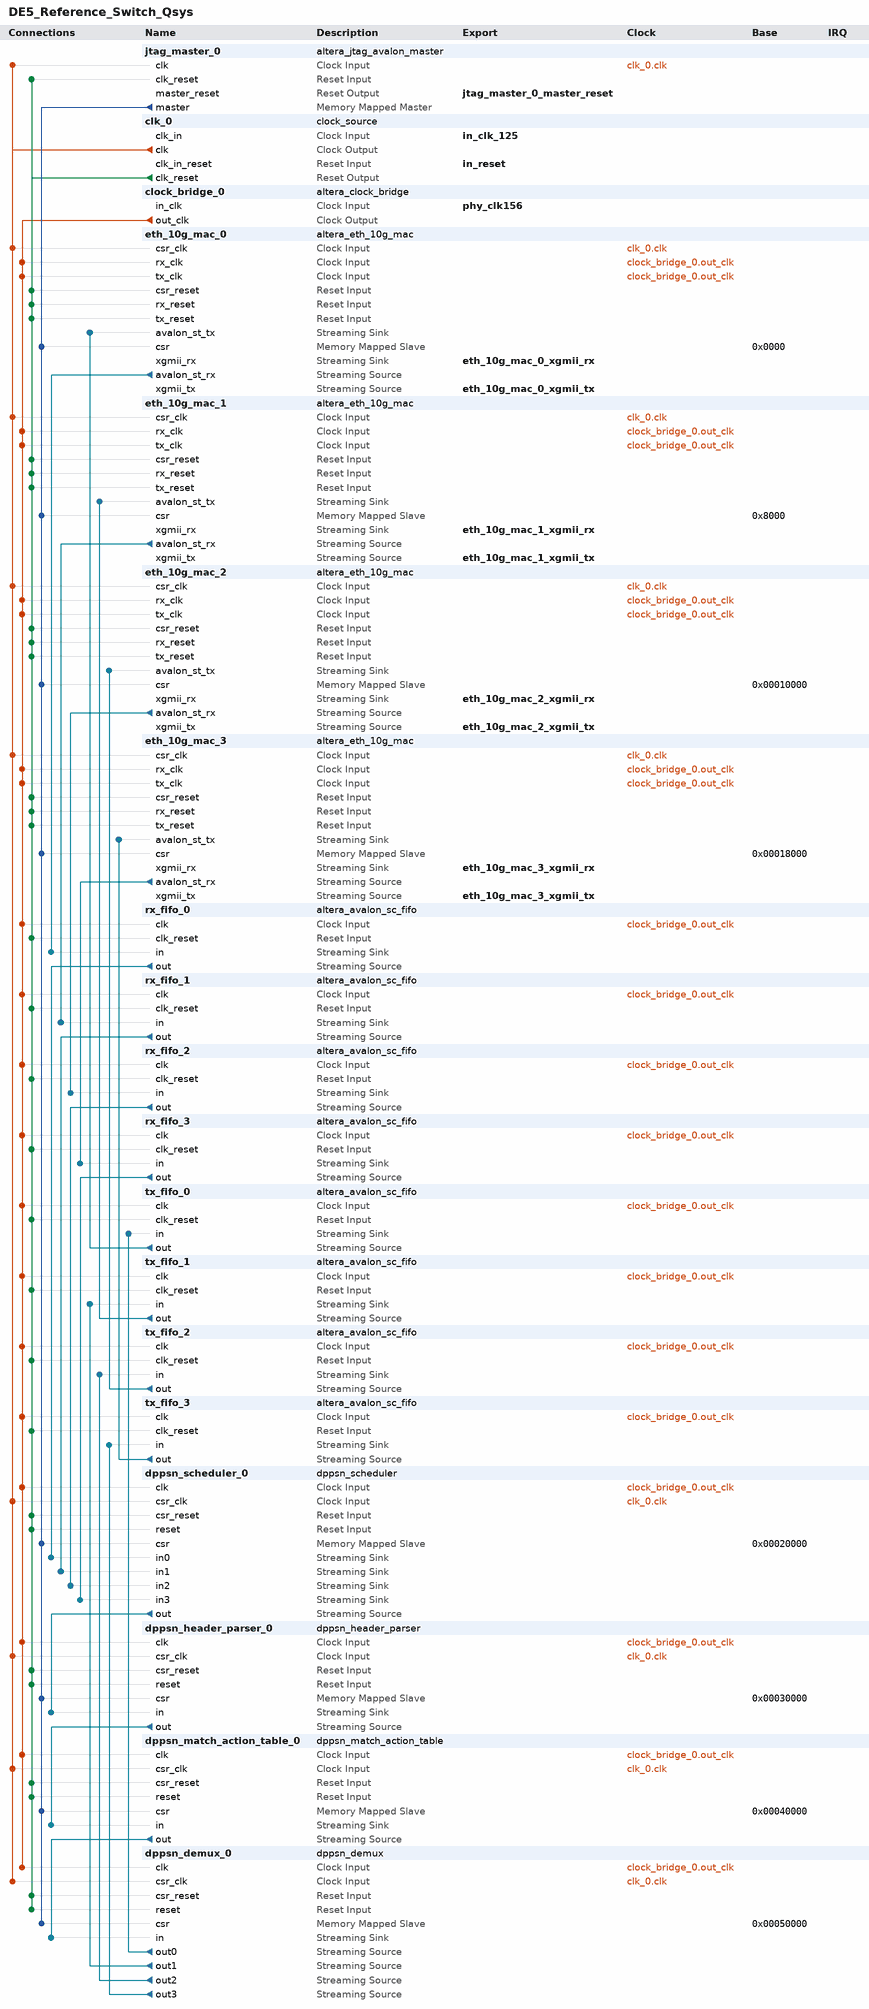
[diagram p0: system contents]
# Platform Designer (Qsys) system DE5_Reference_Switch_Qsys, Stratix V 5SGXEA7N2F45C2
# Parameters at their usual value, and those the tool derives, are not listed.
package require -exact qsys 16.1
create_system DE5_Reference_Switch_Qsys
set_project_property DEVICE_FAMILY {Stratix V}
set_project_property DEVICE 5SGXEA7N2F45C2

add_instance jtag_master_0 altera_jtag_avalon_master 16.1

add_instance clk_0 clock_source 16.1
set_instance_parameter_value clk_0 clockFrequency 156250000

add_instance clock_bridge_0 altera_clock_bridge 16.1
set_instance_parameter_value clock_bridge_0 DERIVED_CLOCK_RATE 0
set_instance_parameter_value clock_bridge_0 EXPLICIT_CLOCK_RATE 156250000

add_instance eth_10g_mac_0 altera_eth_10g_mac 16.1
set_instance_parameter_value eth_10g_mac_0 DATAPATH_OPTION 3
set_instance_parameter_value eth_10g_mac_0 ENABLE_1G10G_MAC 0
set_instance_parameter_value eth_10g_mac_0 ENABLE_PFC 0
set_instance_parameter_value eth_10g_mac_0 ENABLE_PTP_1STEP 0
set_instance_parameter_value eth_10g_mac_0 ENABLE_SUPP_ADDR 1
set_instance_parameter_value eth_10g_mac_0 ENABLE_TIMESTAMPING 0
set_instance_parameter_value eth_10g_mac_0 ENABLE_UNIDIRECTIONAL 0
set_instance_parameter_value eth_10g_mac_0 INSTANTIATE_STATISTICS 1
set_instance_parameter_value eth_10g_mac_0 INSTANTIATE_TX_CRC 1
set_instance_parameter_value eth_10g_mac_0 PFC_PRIORITY_NUM 8
set_instance_parameter_value eth_10g_mac_0 PREAMBLE_PASSTHROUGH 0
set_instance_parameter_value eth_10g_mac_0 REGISTER_BASED_STATISTICS 0
set_instance_parameter_value eth_10g_mac_0 TSTAMP_FP_WIDTH 4

add_instance eth_10g_mac_1 altera_eth_10g_mac 16.1
set_instance_parameter_value eth_10g_mac_1 DATAPATH_OPTION 3
set_instance_parameter_value eth_10g_mac_1 ENABLE_1G10G_MAC 0
set_instance_parameter_value eth_10g_mac_1 ENABLE_PFC 0
set_instance_parameter_value eth_10g_mac_1 ENABLE_PTP_1STEP 0
set_instance_parameter_value eth_10g_mac_1 ENABLE_SUPP_ADDR 1
set_instance_parameter_value eth_10g_mac_1 ENABLE_TIMESTAMPING 0
set_instance_parameter_value eth_10g_mac_1 ENABLE_UNIDIRECTIONAL 0
set_instance_parameter_value eth_10g_mac_1 INSTANTIATE_STATISTICS 1
set_instance_parameter_value eth_10g_mac_1 INSTANTIATE_TX_CRC 1
set_instance_parameter_value eth_10g_mac_1 PFC_PRIORITY_NUM 8
set_instance_parameter_value eth_10g_mac_1 PREAMBLE_PASSTHROUGH 0
set_instance_parameter_value eth_10g_mac_1 REGISTER_BASED_STATISTICS 0
set_instance_parameter_value eth_10g_mac_1 TSTAMP_FP_WIDTH 4

add_instance eth_10g_mac_2 altera_eth_10g_mac 16.1
set_instance_parameter_value eth_10g_mac_2 DATAPATH_OPTION 3
set_instance_parameter_value eth_10g_mac_2 ENABLE_1G10G_MAC 0
set_instance_parameter_value eth_10g_mac_2 ENABLE_PFC 0
set_instance_parameter_value eth_10g_mac_2 ENABLE_PTP_1STEP 0
set_instance_parameter_value eth_10g_mac_2 ENABLE_SUPP_ADDR 1
set_instance_parameter_value eth_10g_mac_2 ENABLE_TIMESTAMPING 0
set_instance_parameter_value eth_10g_mac_2 ENABLE_UNIDIRECTIONAL 0
set_instance_parameter_value eth_10g_mac_2 INSTANTIATE_STATISTICS 1
set_instance_parameter_value eth_10g_mac_2 INSTANTIATE_TX_CRC 1
set_instance_parameter_value eth_10g_mac_2 PFC_PRIORITY_NUM 8
set_instance_parameter_value eth_10g_mac_2 PREAMBLE_PASSTHROUGH 0
set_instance_parameter_value eth_10g_mac_2 REGISTER_BASED_STATISTICS 0
set_instance_parameter_value eth_10g_mac_2 TSTAMP_FP_WIDTH 4

add_instance eth_10g_mac_3 altera_eth_10g_mac 16.1
set_instance_parameter_value eth_10g_mac_3 DATAPATH_OPTION 3
set_instance_parameter_value eth_10g_mac_3 ENABLE_1G10G_MAC 0
set_instance_parameter_value eth_10g_mac_3 ENABLE_PFC 0
set_instance_parameter_value eth_10g_mac_3 ENABLE_PTP_1STEP 0
set_instance_parameter_value eth_10g_mac_3 ENABLE_SUPP_ADDR 1
set_instance_parameter_value eth_10g_mac_3 ENABLE_TIMESTAMPING 0
set_instance_parameter_value eth_10g_mac_3 ENABLE_UNIDIRECTIONAL 0
set_instance_parameter_value eth_10g_mac_3 INSTANTIATE_STATISTICS 1
set_instance_parameter_value eth_10g_mac_3 INSTANTIATE_TX_CRC 1
set_instance_parameter_value eth_10g_mac_3 PFC_PRIORITY_NUM 8
set_instance_parameter_value eth_10g_mac_3 PREAMBLE_PASSTHROUGH 0
set_instance_parameter_value eth_10g_mac_3 REGISTER_BASED_STATISTICS 0
set_instance_parameter_value eth_10g_mac_3 TSTAMP_FP_WIDTH 4

add_instance rx_fifo_0 altera_avalon_sc_fifo 16.1
set_instance_parameter_value rx_fifo_0 BITS_PER_SYMBOL 8
set_instance_parameter_value rx_fifo_0 CHANNEL_WIDTH 0
set_instance_parameter_value rx_fifo_0 ERROR_WIDTH 0
set_instance_parameter_value rx_fifo_0 FIFO_DEPTH 512
set_instance_parameter_value rx_fifo_0 SYMBOLS_PER_BEAT 8
set_instance_parameter_value rx_fifo_0 USE_FILL_LEVEL 0
set_instance_parameter_value rx_fifo_0 USE_MEMORY_BLOCKS 1
set_instance_parameter_value rx_fifo_0 USE_PACKETS 1
set_instance_parameter_value rx_fifo_0 USE_STORE_FORWARD 0

add_instance rx_fifo_1 altera_avalon_sc_fifo 16.1
set_instance_parameter_value rx_fifo_1 BITS_PER_SYMBOL 8
set_instance_parameter_value rx_fifo_1 CHANNEL_WIDTH 0
set_instance_parameter_value rx_fifo_1 ERROR_WIDTH 0
set_instance_parameter_value rx_fifo_1 FIFO_DEPTH 512
set_instance_parameter_value rx_fifo_1 SYMBOLS_PER_BEAT 8
set_instance_parameter_value rx_fifo_1 USE_FILL_LEVEL 0
set_instance_parameter_value rx_fifo_1 USE_MEMORY_BLOCKS 1
set_instance_parameter_value rx_fifo_1 USE_PACKETS 1
set_instance_parameter_value rx_fifo_1 USE_STORE_FORWARD 0

add_instance rx_fifo_2 altera_avalon_sc_fifo 16.1
set_instance_parameter_value rx_fifo_2 BITS_PER_SYMBOL 8
set_instance_parameter_value rx_fifo_2 CHANNEL_WIDTH 0
set_instance_parameter_value rx_fifo_2 ERROR_WIDTH 0
set_instance_parameter_value rx_fifo_2 FIFO_DEPTH 512
set_instance_parameter_value rx_fifo_2 SYMBOLS_PER_BEAT 8
set_instance_parameter_value rx_fifo_2 USE_FILL_LEVEL 0
set_instance_parameter_value rx_fifo_2 USE_MEMORY_BLOCKS 1
set_instance_parameter_value rx_fifo_2 USE_PACKETS 1
set_instance_parameter_value rx_fifo_2 USE_STORE_FORWARD 0

add_instance rx_fifo_3 altera_avalon_sc_fifo 16.1
set_instance_parameter_value rx_fifo_3 BITS_PER_SYMBOL 8
set_instance_parameter_value rx_fifo_3 CHANNEL_WIDTH 0
set_instance_parameter_value rx_fifo_3 ERROR_WIDTH 0
set_instance_parameter_value rx_fifo_3 FIFO_DEPTH 512
set_instance_parameter_value rx_fifo_3 SYMBOLS_PER_BEAT 8
set_instance_parameter_value rx_fifo_3 USE_FILL_LEVEL 0
set_instance_parameter_value rx_fifo_3 USE_MEMORY_BLOCKS 1
set_instance_parameter_value rx_fifo_3 USE_PACKETS 1
set_instance_parameter_value rx_fifo_3 USE_STORE_FORWARD 0

add_instance tx_fifo_0 altera_avalon_sc_fifo 16.1
set_instance_parameter_value tx_fifo_0 BITS_PER_SYMBOL 8
set_instance_parameter_value tx_fifo_0 CHANNEL_WIDTH 0
set_instance_parameter_value tx_fifo_0 ERROR_WIDTH 0
set_instance_parameter_value tx_fifo_0 FIFO_DEPTH 512
set_instance_parameter_value tx_fifo_0 SYMBOLS_PER_BEAT 8
set_instance_parameter_value tx_fifo_0 USE_FILL_LEVEL 0
set_instance_parameter_value tx_fifo_0 USE_MEMORY_BLOCKS 1
set_instance_parameter_value tx_fifo_0 USE_PACKETS 1
set_instance_parameter_value tx_fifo_0 USE_STORE_FORWARD 0

add_instance tx_fifo_1 altera_avalon_sc_fifo 16.1
set_instance_parameter_value tx_fifo_1 BITS_PER_SYMBOL 8
set_instance_parameter_value tx_fifo_1 CHANNEL_WIDTH 0
set_instance_parameter_value tx_fifo_1 ERROR_WIDTH 0
set_instance_parameter_value tx_fifo_1 FIFO_DEPTH 512
set_instance_parameter_value tx_fifo_1 SYMBOLS_PER_BEAT 8
set_instance_parameter_value tx_fifo_1 USE_FILL_LEVEL 0
set_instance_parameter_value tx_fifo_1 USE_MEMORY_BLOCKS 1
set_instance_parameter_value tx_fifo_1 USE_PACKETS 1
set_instance_parameter_value tx_fifo_1 USE_STORE_FORWARD 0

add_instance tx_fifo_2 altera_avalon_sc_fifo 16.1
set_instance_parameter_value tx_fifo_2 BITS_PER_SYMBOL 8
set_instance_parameter_value tx_fifo_2 CHANNEL_WIDTH 0
set_instance_parameter_value tx_fifo_2 ERROR_WIDTH 0
set_instance_parameter_value tx_fifo_2 FIFO_DEPTH 512
set_instance_parameter_value tx_fifo_2 SYMBOLS_PER_BEAT 8
set_instance_parameter_value tx_fifo_2 USE_FILL_LEVEL 0
set_instance_parameter_value tx_fifo_2 USE_MEMORY_BLOCKS 1
set_instance_parameter_value tx_fifo_2 USE_PACKETS 1
set_instance_parameter_value tx_fifo_2 USE_STORE_FORWARD 0

add_instance tx_fifo_3 altera_avalon_sc_fifo 16.1
set_instance_parameter_value tx_fifo_3 BITS_PER_SYMBOL 8
set_instance_parameter_value tx_fifo_3 CHANNEL_WIDTH 0
set_instance_parameter_value tx_fifo_3 ERROR_WIDTH 0
set_instance_parameter_value tx_fifo_3 FIFO_DEPTH 512
set_instance_parameter_value tx_fifo_3 SYMBOLS_PER_BEAT 8
set_instance_parameter_value tx_fifo_3 USE_FILL_LEVEL 0
set_instance_parameter_value tx_fifo_3 USE_MEMORY_BLOCKS 1
set_instance_parameter_value tx_fifo_3 USE_PACKETS 1
set_instance_parameter_value tx_fifo_3 USE_STORE_FORWARD 0

add_instance dppsn_scheduler_0 dppsn_scheduler 1.0

add_instance dppsn_header_parser_0 dppsn_header_parser 1.0

add_instance dppsn_match_action_table_0 dppsn_match_action_table 1.0

add_instance dppsn_demux_0 dppsn_demux 1.0

# connections
add_connection clk_0.clk dppsn_demux_0.csr_clk clock
add_connection clk_0.clk dppsn_header_parser_0.csr_clk clock
add_connection clk_0.clk dppsn_match_action_table_0.csr_clk clock
add_connection clk_0.clk dppsn_scheduler_0.csr_clk clock
add_connection clk_0.clk eth_10g_mac_0.csr_clk clock
add_connection clk_0.clk eth_10g_mac_1.csr_clk clock
add_connection clk_0.clk eth_10g_mac_2.csr_clk clock
add_connection clk_0.clk eth_10g_mac_3.csr_clk clock
add_connection clk_0.clk jtag_master_0.clk clock
add_connection clock_bridge_0.out_clk dppsn_demux_0.clk clock
add_connection clock_bridge_0.out_clk dppsn_header_parser_0.clk clock
add_connection clock_bridge_0.out_clk dppsn_match_action_table_0.clk clock
add_connection clock_bridge_0.out_clk dppsn_scheduler_0.clk clock
add_connection clock_bridge_0.out_clk eth_10g_mac_0.rx_clk clock
add_connection clock_bridge_0.out_clk eth_10g_mac_0.tx_clk clock
add_connection clock_bridge_0.out_clk eth_10g_mac_1.rx_clk clock
add_connection clock_bridge_0.out_clk eth_10g_mac_1.tx_clk clock
add_connection clock_bridge_0.out_clk eth_10g_mac_2.rx_clk clock
add_connection clock_bridge_0.out_clk eth_10g_mac_2.tx_clk clock
add_connection clock_bridge_0.out_clk eth_10g_mac_3.rx_clk clock
add_connection clock_bridge_0.out_clk eth_10g_mac_3.tx_clk clock
add_connection clock_bridge_0.out_clk rx_fifo_0.clk clock
add_connection clock_bridge_0.out_clk rx_fifo_1.clk clock
add_connection clock_bridge_0.out_clk rx_fifo_2.clk clock
add_connection clock_bridge_0.out_clk rx_fifo_3.clk clock
add_connection clock_bridge_0.out_clk tx_fifo_0.clk clock
add_connection clock_bridge_0.out_clk tx_fifo_1.clk clock
add_connection clock_bridge_0.out_clk tx_fifo_2.clk clock
add_connection clock_bridge_0.out_clk tx_fifo_3.clk clock
add_connection clk_0.clk_reset dppsn_demux_0.csr_reset reset
add_connection clk_0.clk_reset dppsn_demux_0.reset reset
add_connection clk_0.clk_reset dppsn_header_parser_0.csr_reset reset
add_connection clk_0.clk_reset dppsn_header_parser_0.reset reset
add_connection clk_0.clk_reset dppsn_match_action_table_0.csr_reset reset
add_connection clk_0.clk_reset dppsn_match_action_table_0.reset reset
add_connection clk_0.clk_reset dppsn_scheduler_0.csr_reset reset
add_connection clk_0.clk_reset dppsn_scheduler_0.reset reset
add_connection clk_0.clk_reset eth_10g_mac_0.csr_reset reset
add_connection clk_0.clk_reset eth_10g_mac_0.rx_reset reset
add_connection clk_0.clk_reset eth_10g_mac_0.tx_reset reset
add_connection clk_0.clk_reset eth_10g_mac_1.csr_reset reset
add_connection clk_0.clk_reset eth_10g_mac_1.rx_reset reset
add_connection clk_0.clk_reset eth_10g_mac_1.tx_reset reset
add_connection clk_0.clk_reset eth_10g_mac_2.csr_reset reset
add_connection clk_0.clk_reset eth_10g_mac_2.rx_reset reset
add_connection clk_0.clk_reset eth_10g_mac_2.tx_reset reset
add_connection clk_0.clk_reset eth_10g_mac_3.csr_reset reset
add_connection clk_0.clk_reset eth_10g_mac_3.rx_reset reset
add_connection clk_0.clk_reset eth_10g_mac_3.tx_reset reset
add_connection clk_0.clk_reset jtag_master_0.clk_reset reset
add_connection clk_0.clk_reset rx_fifo_0.clk_reset reset
add_connection clk_0.clk_reset rx_fifo_1.clk_reset reset
add_connection clk_0.clk_reset rx_fifo_2.clk_reset reset
add_connection clk_0.clk_reset rx_fifo_3.clk_reset reset
add_connection clk_0.clk_reset tx_fifo_0.clk_reset reset
add_connection clk_0.clk_reset tx_fifo_1.clk_reset reset
add_connection clk_0.clk_reset tx_fifo_2.clk_reset reset
add_connection clk_0.clk_reset tx_fifo_3.clk_reset reset
add_connection jtag_master_0.master dppsn_demux_0.csr avalon
set_connection_parameter_value jtag_master_0.master/dppsn_demux_0.csr baseAddress 0x00050000
add_connection jtag_master_0.master dppsn_header_parser_0.csr avalon
set_connection_parameter_value jtag_master_0.master/dppsn_header_parser_0.csr baseAddress 0x00030000
add_connection jtag_master_0.master dppsn_match_action_table_0.csr avalon
set_connection_parameter_value jtag_master_0.master/dppsn_match_action_table_0.csr baseAddress 0x00040000
add_connection jtag_master_0.master dppsn_scheduler_0.csr avalon
set_connection_parameter_value jtag_master_0.master/dppsn_scheduler_0.csr baseAddress 0x00020000
add_connection jtag_master_0.master eth_10g_mac_0.csr avalon
set_connection_parameter_value jtag_master_0.master/eth_10g_mac_0.csr baseAddress 0x0000
add_connection jtag_master_0.master eth_10g_mac_1.csr avalon
set_connection_parameter_value jtag_master_0.master/eth_10g_mac_1.csr baseAddress 0x8000
add_connection jtag_master_0.master eth_10g_mac_2.csr avalon
set_connection_parameter_value jtag_master_0.master/eth_10g_mac_2.csr baseAddress 0x00010000
add_connection jtag_master_0.master eth_10g_mac_3.csr avalon
set_connection_parameter_value jtag_master_0.master/eth_10g_mac_3.csr baseAddress 0x00018000
add_connection dppsn_demux_0.out0 tx_fifo_0.in avalon_streaming
add_connection dppsn_demux_0.out1 tx_fifo_1.in avalon_streaming
add_connection dppsn_demux_0.out2 tx_fifo_2.in avalon_streaming
add_connection dppsn_demux_0.out3 tx_fifo_3.in avalon_streaming
add_connection dppsn_header_parser_0.out dppsn_match_action_table_0.in avalon_streaming
add_connection dppsn_match_action_table_0.out dppsn_demux_0.in avalon_streaming
add_connection dppsn_scheduler_0.out dppsn_header_parser_0.in avalon_streaming
add_connection eth_10g_mac_0.avalon_st_rx rx_fifo_0.in avalon_streaming
add_connection eth_10g_mac_1.avalon_st_rx rx_fifo_1.in avalon_streaming
add_connection eth_10g_mac_2.avalon_st_rx rx_fifo_2.in avalon_streaming
add_connection eth_10g_mac_3.avalon_st_rx rx_fifo_3.in avalon_streaming
add_connection rx_fifo_0.out dppsn_scheduler_0.in0 avalon_streaming
add_connection rx_fifo_1.out dppsn_scheduler_0.in1 avalon_streaming
add_connection rx_fifo_2.out dppsn_scheduler_0.in2 avalon_streaming
add_connection rx_fifo_3.out dppsn_scheduler_0.in3 avalon_streaming
add_connection tx_fifo_0.out eth_10g_mac_0.avalon_st_tx avalon_streaming
add_connection tx_fifo_1.out eth_10g_mac_1.avalon_st_tx avalon_streaming
add_connection tx_fifo_2.out eth_10g_mac_2.avalon_st_tx avalon_streaming
add_connection tx_fifo_3.out eth_10g_mac_3.avalon_st_tx avalon_streaming

# exported interfaces
add_interface eth_10g_mac_0_xgmii_rx avalon_streaming sink
set_interface_property eth_10g_mac_0_xgmii_rx EXPORT_OF eth_10g_mac_0.xgmii_rx
add_interface eth_10g_mac_0_xgmii_tx avalon_streaming source
set_interface_property eth_10g_mac_0_xgmii_tx EXPORT_OF eth_10g_mac_0.xgmii_tx
add_interface eth_10g_mac_1_xgmii_rx avalon_streaming sink
set_interface_property eth_10g_mac_1_xgmii_rx EXPORT_OF eth_10g_mac_1.xgmii_rx
add_interface eth_10g_mac_1_xgmii_tx avalon_streaming source
set_interface_property eth_10g_mac_1_xgmii_tx EXPORT_OF eth_10g_mac_1.xgmii_tx
add_interface eth_10g_mac_2_xgmii_rx avalon_streaming sink
set_interface_property eth_10g_mac_2_xgmii_rx EXPORT_OF eth_10g_mac_2.xgmii_rx
add_interface eth_10g_mac_2_xgmii_tx avalon_streaming source
set_interface_property eth_10g_mac_2_xgmii_tx EXPORT_OF eth_10g_mac_2.xgmii_tx
add_interface eth_10g_mac_3_xgmii_rx avalon_streaming sink
set_interface_property eth_10g_mac_3_xgmii_rx EXPORT_OF eth_10g_mac_3.xgmii_rx
add_interface eth_10g_mac_3_xgmii_tx avalon_streaming source
set_interface_property eth_10g_mac_3_xgmii_tx EXPORT_OF eth_10g_mac_3.xgmii_tx
add_interface in_clk_125 clock sink
set_interface_property in_clk_125 EXPORT_OF clk_0.clk_in
add_interface in_reset reset sink
set_interface_property in_reset EXPORT_OF clk_0.clk_in_reset
add_interface jtag_master_0_master_reset reset source
set_interface_property jtag_master_0_master_reset EXPORT_OF jtag_master_0.master_reset
add_interface phy_clk156 clock sink
set_interface_property phy_clk156 EXPORT_OF clock_bridge_0.in_clk

set_interconnect_requirement {$system} qsys_mm.clockCrossingAdapter HANDSHAKE
set_interconnect_requirement {$system} qsys_mm.insertDefaultSlave false
set_interconnect_requirement {$system} qsys_mm.maxAdditionalLatency 1

save_system DE5_Reference_Switch_Qsys.qsys
